# Altium schematic sheet E17-15-Charge_Cart.SchDoc
size A
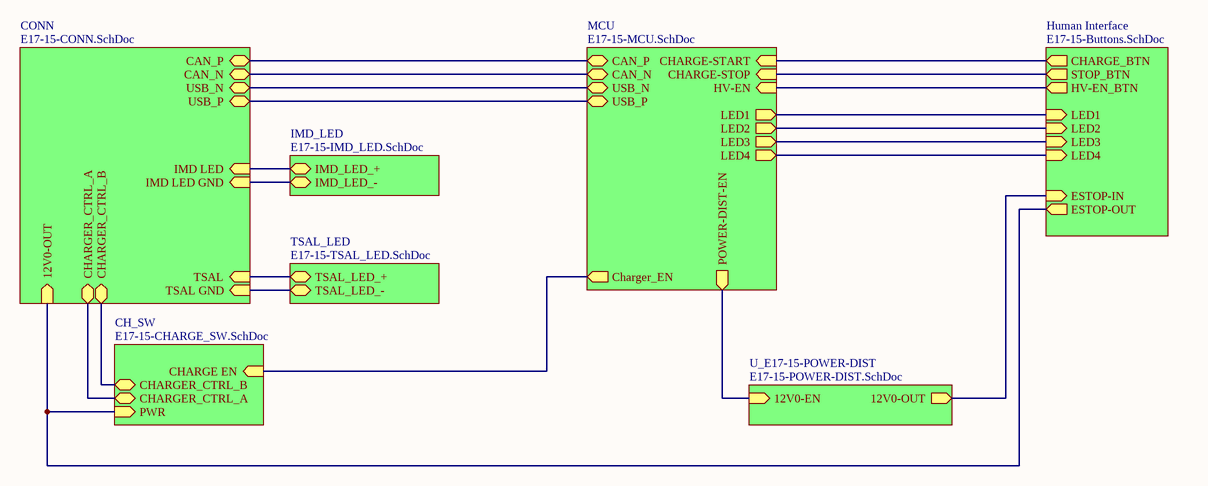
[diagram p0: E17-15-Charge_Cart.SchDoc]

## Sub-sheets
CH_SW = E17-15-CHARGE_SW.SchDoc: CHARGE EN (in), CHARGER_CTRL_B (bidir), CHARGER_CTRL_A (bidir), PWR (in)
CONN = E17-15-CONN.SchDoc: IMD LED (in), CAN_P (bidir), CAN_N (bidir), IMD LED GND (in), TSAL GND (in), TSAL (in), CHARGER_CTRL_B (bidir), CHARGER_CTRL_A (bidir), USB_N (bidir), USB_P (bidir), 12V0-OUT (in)
Human Interface = E17-15-Buttons.SchDoc: CHARGE_BTN (out), STOP_BTN (out), HV-EN_BTN (out), ESTOP-IN (in), ESTOP-OUT (out), LED1 (in), LED2 (in), LED3 (in), LED4 (in)
IMD_LED = E17-15-IMD_LED.SchDoc: IMD_LED_+ (bidir), IMD_LED_- (bidir)
MCU = E17-15-MCU.SchDoc: CAN_N (bidir), USB_N (bidir), USB_P (bidir), CAN_P (bidir), Charger_EN (out), CHARGE-STOP (in), HV-EN (in), CHARGE-START (in), POWER-DIST-EN (out), LED1 (out), LED2 (out), LED3 (out), LED4 (out)
TSAL_LED = E17-15-TSAL_LED.SchDoc: TSAL_LED_- (bidir), TSAL_LED_+ (bidir)
U_E17-15-POWER-DIST = E17-15-POWER-DIST.SchDoc: 12V0-OUT (out), 12V0-EN (in)

## Nets
(unnamed): sheet MCU/CAN_N, sheet CONN/CAN_N
(unnamed): sheet MCU/USB_N, sheet CONN/USB_N
(unnamed): sheet MCU/USB_P, sheet CONN/USB_P
(unnamed): sheet MCU/CAN_P, sheet CONN/CAN_P
(unnamed): sheet MCU/Charger_EN, sheet CH_SW/CHARGE EN
(unnamed): sheet MCU/CHARGE-STOP, sheet Human Interface/STOP_BTN
(unnamed): sheet MCU/HV-EN, sheet Human Interface/HV-EN_BTN
(unnamed): sheet MCU/CHARGE-START, sheet Human Interface/CHARGE_BTN
(unnamed): sheet MCU/POWER-DIST-EN, sheet U_E17-15-POWER-DIST/12V0-EN
(unnamed): sheet MCU/LED1, sheet Human Interface/LED1
(unnamed): sheet MCU/LED2, sheet Human Interface/LED2
(unnamed): sheet MCU/LED3, sheet Human Interface/LED3
(unnamed): sheet MCU/LED4, sheet Human Interface/LED4
(unnamed): sheet CONN/IMD LED, sheet IMD_LED/IMD_LED_+
(unnamed): sheet CONN/IMD LED GND, sheet IMD_LED/IMD_LED_-
(unnamed): sheet CONN/TSAL GND, sheet TSAL_LED/TSAL_LED_-
(unnamed): sheet CONN/TSAL, sheet TSAL_LED/TSAL_LED_+
(unnamed): sheet CONN/CHARGER_CTRL_B, sheet CH_SW/CHARGER_CTRL_B
(unnamed): sheet CONN/CHARGER_CTRL_A, sheet CH_SW/CHARGER_CTRL_A
(unnamed): sheet CONN/12V0-OUT, sheet CH_SW/PWR, sheet Human Interface/ESTOP-OUT
(unnamed): sheet Human Interface/ESTOP-IN, sheet U_E17-15-POWER-DIST/12V0-OUT